# Altium schematic sheet 20 AUX VOLT REG.SchDoc
size 513 x 386 mm
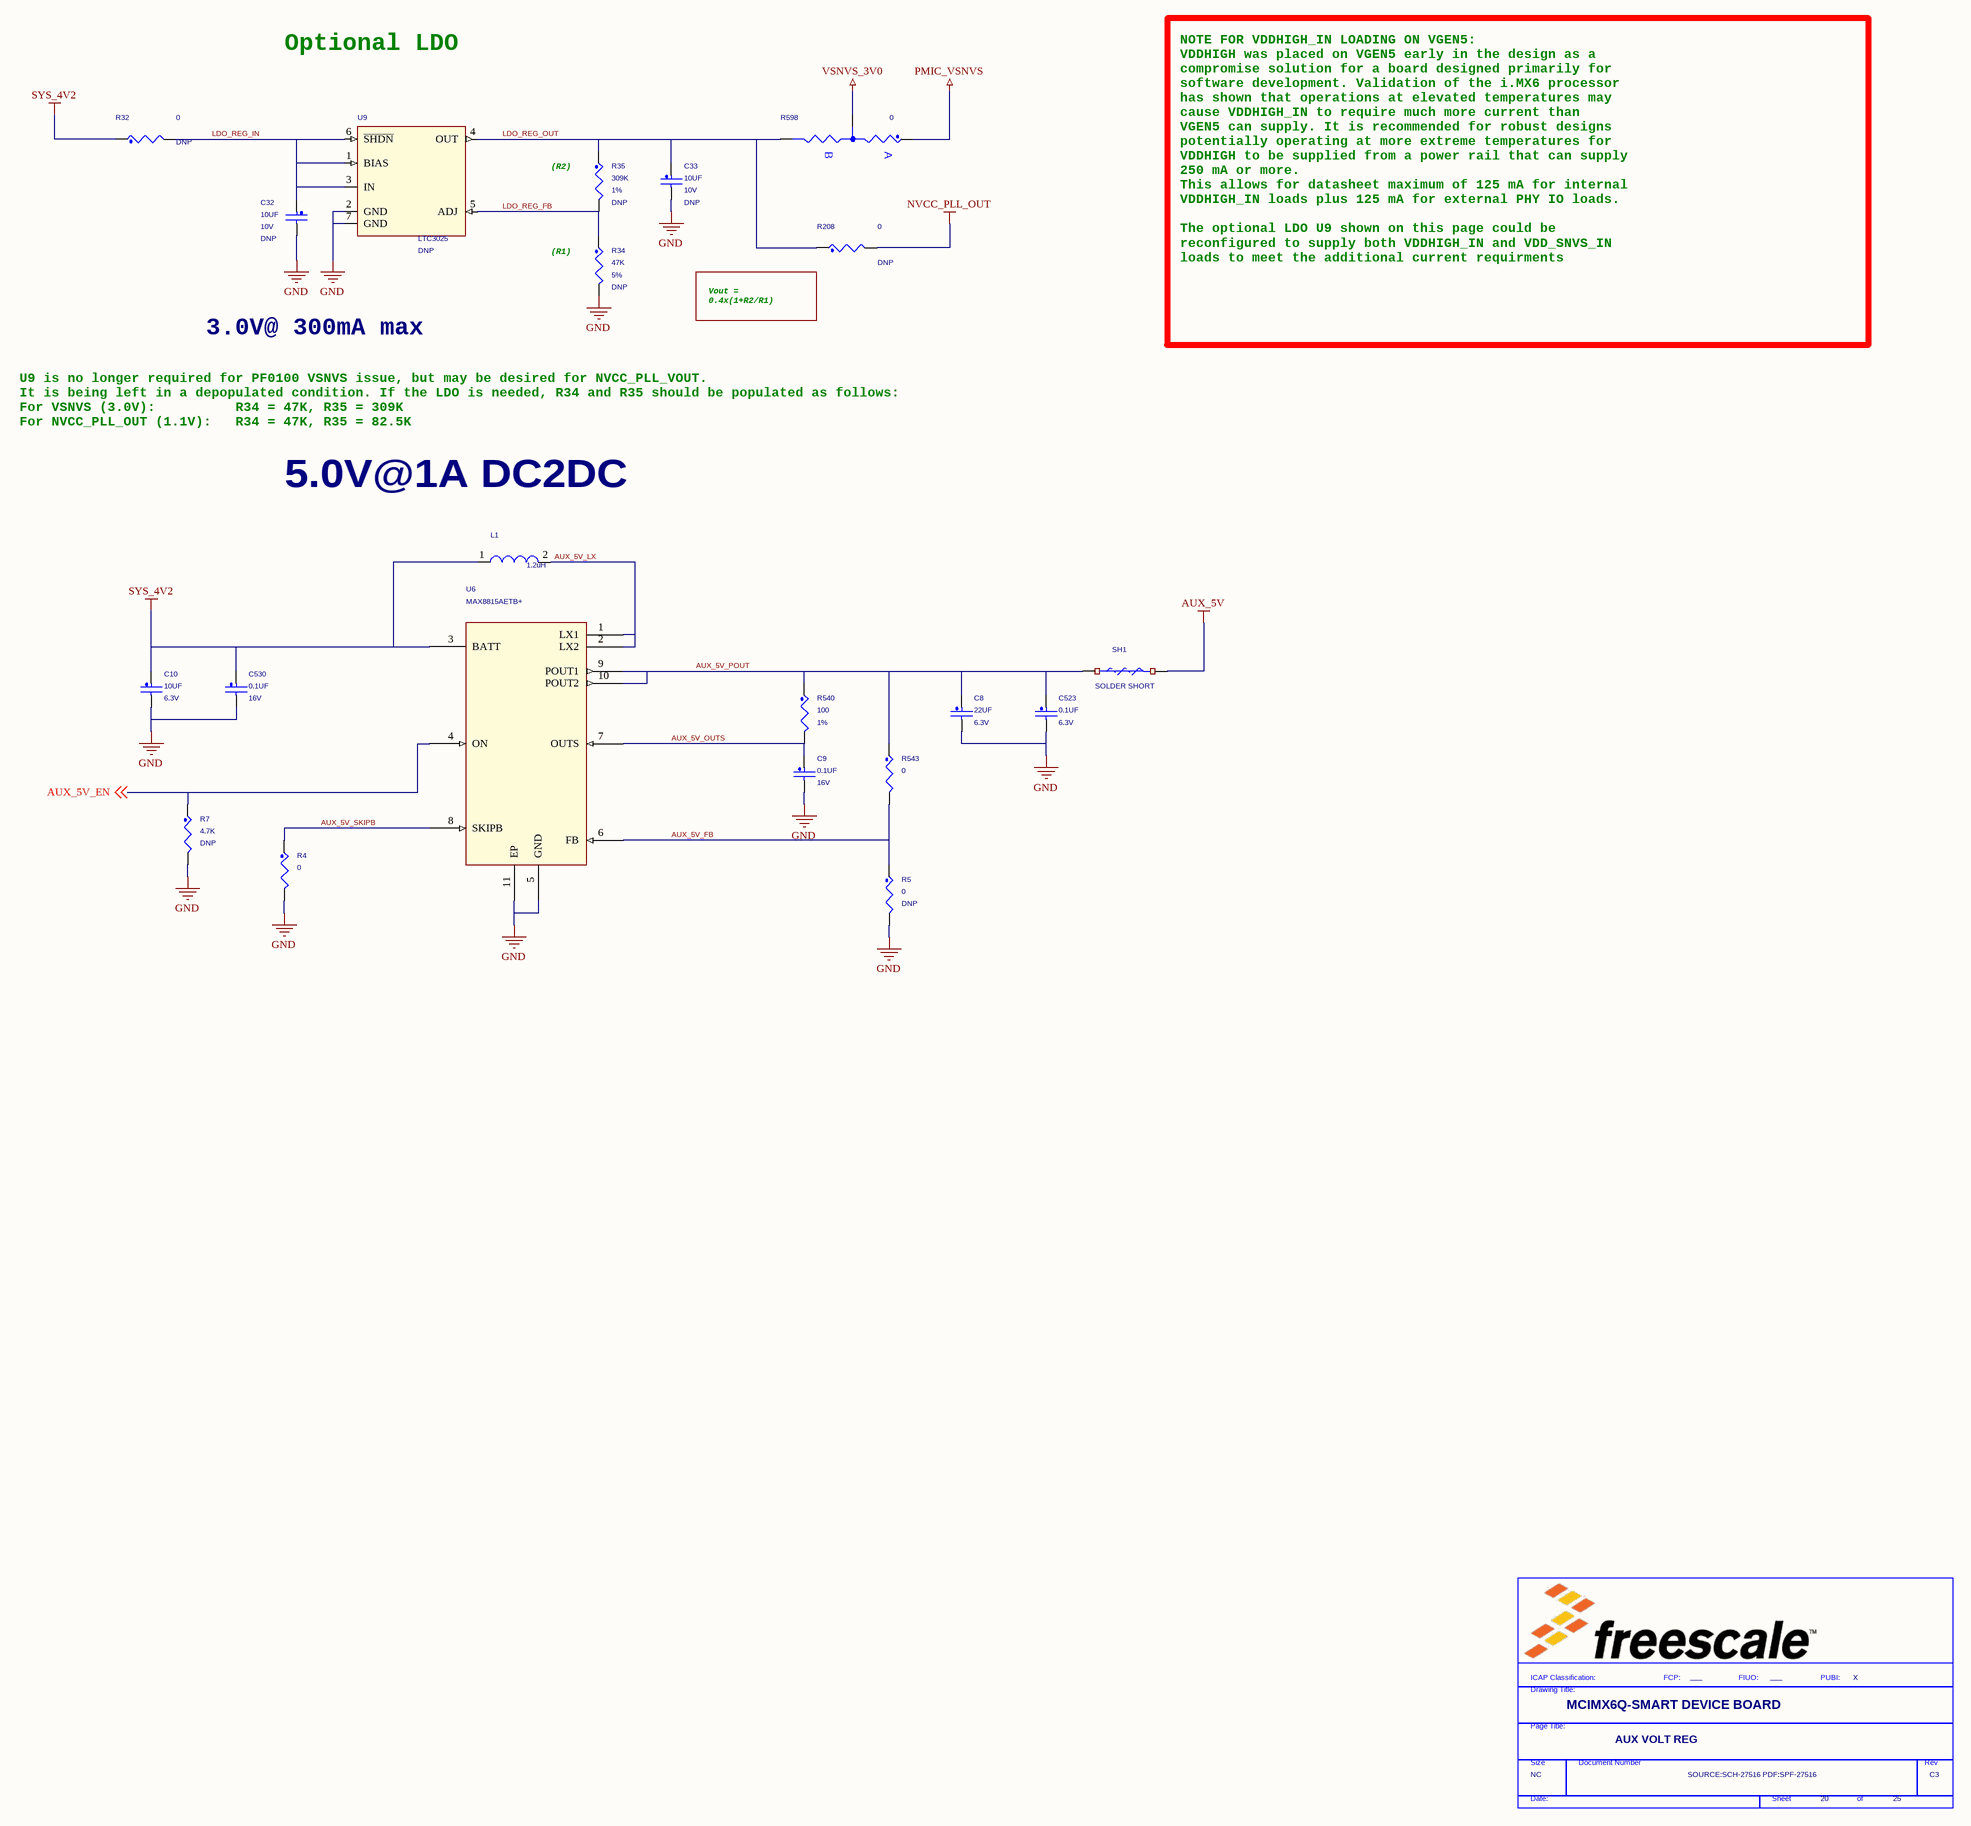
[diagram p0: 20 AUX VOLT REG.SchDoc]

## Parts
*  FIUO: ___  PUBI: X  Doc: SOURCE:SCH-27516 PDF:SPF-27516  RevCode: C3  Title: MCIMX6Q-SMART DEVICE BOARD  Page Size: NC  Page Number: 20  Page Count: 25  PageTitle: AUX VOLT REG  (hidden comment: TitleBlock_FS)  (graphical)
C8  22UF  WVDC: 6.3V  [0805_CC]
C9  0.1UF  WVDC: 16V  [0402_CC]
C10  10UF  WVDC: 6.3V  [0603_CC]
C32  10UF  ASSY_OPT: DNP  WVDC: 10V  [0603_CC]
C33  10UF  ASSY_OPT: DNP  WVDC: 10V  [0603_CC]
C523  0.1UF  WVDC: 6.3V  [0201_CC]
C530  0.1UF  WVDC: 16V  [0402_CC]
L1  1.2uH  [ind_vlcf4018]
R4  0  [0402_CC]
R5  0  ASSY_OPT: DNP  [0402_CC]
R7  4.7K  ASSY_OPT: DNP  [0402_CC]
R32  0  ASSY_OPT: DNP  [0805_CC]
R34  47K  ASSY_OPT: DNP  Tolerance: 5%  [0402_CC]
R35  309K  ASSY_OPT: DNP  Tolerance: 1%  [0402_CC]
R208  0  ASSY_OPT: DNP  [0805_CC]
R540  100  Tolerance: 1%  [0402_CC]
R543  0  [0402_CC]
R598  0  [R603-X2]
SH1  SOLDER SHORT  [SH0805_40]
U6  MAX8815AETB+  [tdfn10_0p5_3p1x3p1]
U9  LTC3025  ASSY_OPT: DNP  [DFN6_2X2MM]

## Nets
AUX_5V: SH1.2
GND: C8.2 C9.2 C10.2 C32.2 C33.2 C523.2 C530.2 R4.2 R5.2 R7.2 R34.2 U6.5(GND) U6.11(EP) U9.2(GND) U9.7(GND)
NVCC_PLL_OUT: R208.2
PMIC_VSNVS: R598.1
SYS_4V2: C10.1 C530.1 L1.1 R32.1 U6.3(BATT)
VSNVS_3V0: R598.2
AUX_5V_EN: R7.1 U6.4(ON) ; off-sheet AUX_5V_EN
AUX_5V_FB: R5.1 R543.2 U6.6(FB)
AUX_5V_LX: L1.2 U6.1(LX1) U6.2(LX2)
AUX_5V_OUTS: C9.1 R540.2 U6.7(OUTS)
AUX_5V_POUT: C8.1 C523.1 R540.1 R543.1 SH1.1 U6.9(POUT1) U6.10(POUT2)
AUX_5V_SKIPB: R4.1 U6.8(SKIPB)
LDO_REG_FB: R34.1 R35.2 U9.5(ADJ)
LDO_REG_IN: C32.1 R32.2 U9.1(BIAS) U9.3(IN) U9.6(~{SHDN})
LDO_REG_OUT: C33.1 R35.1 R208.1 R598.3 U9.4(OUT)

## Notes on the sheet
- NOTE FOR VDDHIGH_IN LOADING ON VGEN5:
  VDDHIGH was placed on VGEN5 early in the design as a
  compromise solution for a board designed primarily for
  software development. Validation of the i.MX6 processor
  has shown that operations at elevated temperatures may
  cause VDDHIGH_IN to require much more current than
  VGEN5 can supply. It is recommended for robust designs
  potentially operating at more extreme temperatures for
  VDDHIGH to be supplied from a power rail that can supply
  250 mA or more.
  This allows for datasheet maximum of 125 mA for internal
  VDDHIGH_IN loads plus 125 mA for external PHY IO loads.
  The optional LDO U9 shown on this page could be
  reconfigured to supply both VDDHIGH_IN and VDD_SNVS_IN
  loads to meet the additional current requirments
- Optional LDO
- (near R35) (R2)
- (near R34) (R1)
- (near R208) Vout =
  0.4x(1+R2/R1)
- U9 is no longer required for PF0100 VSNVS issue, but may be desired for NVCC_PLL_VOUT.
  It is being left in a depopulated condition. If the LDO is needed, R34 and R35 should be populated as follows:
  For VSNVS (3.0V):          R34 = 47K, R35 = 309K
  For NVCC_PLL_OUT (1.1V):   R34 = 47K, R35 = 82.5K
- 3.0V@ 300mA max
- 5.0V@1A DC2DC
- (in symbol RES_0603_X2) B; A
- (in symbol TitleBlock_FS) ICAP Classification:; FCP:; FIUO:; PUBI:; Drawing Title:; Page Title:; Size; Document Number; Rev; Date:; Sheet; of

## Library data of the parts
* = TitleBlock_FS: OrgAddr2: Austin, TX 78735-8598; OrgAddr1: 6501 William Cannon Drive West; OrgName: Freescale Semiconductor; FCP: ___; Page Create Date: March  8, 1995
C8 = CAP_NP: CAP CER 22UF 6.3V 20% X5R 0805; CLASS: DISCRETE; SIGNAL_MODEL: DEFAULT_CAPACITOR_2.2e+07pF_2_1; AGILE_PN: 150-30121; MFG_NAME01: MURATA; MFG_PN01: GRM21BR60J226ME39L; CAD_APPROVED: Yes; FPLIST: CC0805_OV,CC0805,0805_CC; VOLTAGE: 6.3V; Tolerance: 20%; ROHS: Yes; HEIGHT: 1.45MM
C9 = CAP_NP: CAP CER 0.1UF 16V 10% X7R 0402; CLASS: DISCRETE; SIGNAL_MODEL: DEFAULT_CAPACITOR_100000pF_2_1; FPLIST: CC0402_25,CC0402_HD,0402_CC; CAD_APPROVED: Yes; MFG_PN01: C0402C104K4RAC; MFG_NAME01: KEMET; AGILE_PN: 150-75182; VOLTAGE: 16V; HEIGHT: 0.635MM; ROHS: Yes; Tolerance: 10%
C10 = CAP_NP: CAP CER 10UF 6.3V 10% X5R 0603; CLASS: DISCRETE; SIGNAL_MODEL: DEFAULT_CAPACITOR_1e+07pF_2_1; FPLIST: CC0603_OV,CC0603,0603_CC; CAD_APPROVED: Yes; MFG_PN01: C1608X5R0J106KT; MFG_NAME01: TDK; AGILE_PN: 150-77832; VOLTAGE: 6.3V; HEIGHT: 1.0MM; ROHS: Yes; Tolerance: 10%
C32 C33 = CAP_NP: CAP CER 10UF 10V 20% X5R 0603; CLASS: DISCRETE; ROOM: SNVS_BK_PS; AGILE_PN: 150-78609; MFG_NAME01: TAIYO YUDEN; MFG_PN01: LMK107BJ106MALTD; CAD_APPROVED: Yes; FPLIST: CC0603_OV,CC0603,0603_CC; PRIORITY_PN: 021-00276; SIGNAL_MODEL: DEFAULT_CAPACITOR_1e+07pF_2_1; ROHS: Yes; HEIGHT: 1.016MM
C523 = CAP_NP: CAP CER 0.1UF 6.3V 10% X5R 0201; CLASS: DISCRETE; SIGNAL_MODEL: DEFAULT_CAPACITOR_100000pF_2_1; AGILE_PN: 150-75429; MFG_NAME01: MURATA; MFG_PN01: GRM033R60J104KE19D; CAD_APPROVED: Yes; FPLIST: CC0201,CC0201_HD,CC0201_3PIN,0201_CC; VOLTAGE: 6.3V; Tolerance: 10%; ROHS: Yes; HEIGHT: 0.33MM
C530 = CAP_NP: CAP CER 0.1UF 16V 10% X7R 0402; CLASS: DISCRETE; SIGNAL_MODEL: DEFAULT_CAPACITOR_100000pF_2_1; AGILE_PN: 150-75182; MFG_NAME01: KEMET; MFG_PN01: C0402C104K4RAC; CAD_APPROVED: Yes; FPLIST: CC0402_25,CC0402_HD,0402_CC; VOLTAGE: 16V; Tolerance: 10%; ROHS: Yes; HEIGHT: 0.635MM
L1 = IND: IND PWR 1.2UH@100KHZ 2.7A 30% SMT; PART_TYPE: INDUCTOR\POWER; CLASS: DISCRETE; SIGNAL_MODEL: DEFAULT_INDUCTOR_1200nH_2_1; AGILE_PN: 180-77928; MFG_NAME01: TDK; MFG_PN01: VLCF4028T-1R2N2R7-2; CAD_APPROVED: Yes; FPLIST: ind_vlcf4018,IND_VLF4018; ROHS: Yes; HEIGHT: 2.8MM
R4 R5 = RES: RES MF ZERO OHM 1/10W -- 0402; CLASS: DISCRETE; SIGNAL_MODEL: DEFAULT_RESISTOR_0.001OHM_2_1; FPLIST: RC0402_25,RC0402_HD,RC0402_X2,0402_CC; CAD_APPROVED: Yes; MFG_PN01: ERJ-2GE0R00X; MFG_NAME01: Panasonic; AGILE_PN: 470-79965; ROHS: Yes
R7 = RES: RES MF 4.70K 1/16W 1% 0402; CLASS: DISCRETE; SIGNAL_MODEL: DEFAULT_RESISTOR_4700OHM_2_1; FPLIST: RC0402_25,RC0402_HD,0402_CC; CAD_APPROVED: Yes; MFG_PN01: RK73H1ETTP4701F; MFG_NAME01: KOA SPEER; AGILE_PN: 470-75418; ROHS: Yes; Tolerance: 1%
R32 R208 = RES: RES MF ZERO OHM 1/8W -- 0805; CLASS: DISCRETE; AGILE_PN: 470-75442; Tolerance: 5%; MFG_NAME01: YAGEO AMERICA; MFG_PN01: RC0805JR-070RL; CAD_APPROVED: Yes; FPLIST: RC0805_OV,RC0805,RC0805_OV_3P,0805_CC; SIGNAL_MODEL: DEFAULT_RESISTOR_0.001OHM_2_1; ROHS: Yes
R34 = RES: RES MF 47K 1/16W 5% 0402; CLASS: DISCRETE; SIGNAL_MODEL: DEFAULT_RESISTOR_51OHM_2_1; PRIORITY_PN: 006-00771; FPLIST: RC0402_25,RC0402_HD,0402_CC; CAD_APPROVED: Yes; MFG_PN01: CR0402-16W-473JT; MFG_NAME01: VENKEL COMPANY; AGILE_PN: 470-75559; ROOM: SNVS_BK_PS; ROHS: Yes
R35 = RES: RES MF 309K  1/16W 1% 0402; CLASS: DISCRETE; FPLIST: RC0402_25,RC0402_HD,0402_CC; CAD_APPROVED: Yes; MFG_PN01: RK73H1ETTP3093F; MFG_NAME01: KOA SPEER; AGILE_PN: 470-31114; SIGNAL_MODEL: DEFAULT_RESISTOR_309000OHM_2_1; ROHS: Yes
R540 = RES: RES MF 100 OHM 1/16W 1% 0402; CLASS: DISCRETE; SIGNAL_MODEL: DEFAULT_RESISTOR_100OHM_2_1; FPLIST: RC0402_25,RC0402_HD,0402_CC; CAD_APPROVED: Yes; MFG_PN01: CR-02FL6--100R; MFG_NAME01: THYE MING TECH CO LTD; AGILE_PN: 470-30454; ROHS: Yes
R543 = RES: RES MF ZERO OHM 1/10W -- 0402; CLASS: DISCRETE; SIGNAL_MODEL: DEFAULT_RESISTOR_0.001OHM_2_1; AGILE_PN: 470-79965; MFG_NAME01: Panasonic; MFG_PN01: ERJ-2GE0R00X; CAD_APPROVED: Yes; FPLIST: RC0402_25,RC0402_HD,RC0402_X2,0402_CC; ROHS: Yes
R598 = RES_0603_X2: RES MF ZERO OHM 1/10W -- 0603; CLASS: DISCRETE; AGILE_PN: 470-75407; Tolerance: 1%; MFG_NAME01: VISHAY INTERTECHNOLOGY; MFG_PN01: CRCW06030000Z0EA; CAD_APPROVED: Yes; FPLIST: RC0603_OV,RC0603,R603-X2,0603_CC; ROHS: Yes
SH1 = RES_SHORT-2: SOLDER SHORT 0805  SMT NO PART TO ORDER; CLASS: DISCRETE; FPLIST: SH0805,SH0805CUST,SH0805_40; CAD_APPROVED: Yes; ASSY_OPT: DNP; MFG_PN01: SOLDER_SHORT_0805; MFG_NAME01: NOTACOMPONENT; AGILE_PN: 470-80202; ROHS: Yes
U6 = MAX8815A_TDFN_10P: IC DCDC BOOST SYNC 3.3-5V 1A 1.2-5.5V TDFN10; CAD_APPROVED: Yes; MFG_NAME01: MAXIM; AGILE_PN: 315-79227; CLASS: IC; HEIGHT: 0.8MM; ROHS: Yes; MFG_PN01: MAX8815AETB+
U9 = LTC3025: IC VREG LOW LDO 300MA LOW VREF; AGILE_PN: 315-76204; MFG_NAME01: LINEAR TECHNOLOGY; MFG_PN01: LTC3025EDC#TRPBF; CAD_APPROVED: Yes; PRIORITY_PN: 051-LTC3025EDC; ROOM: SNVS_BK_PS; CLASS: IC; ROHS: Yes; HEIGHT: 0.80 MM